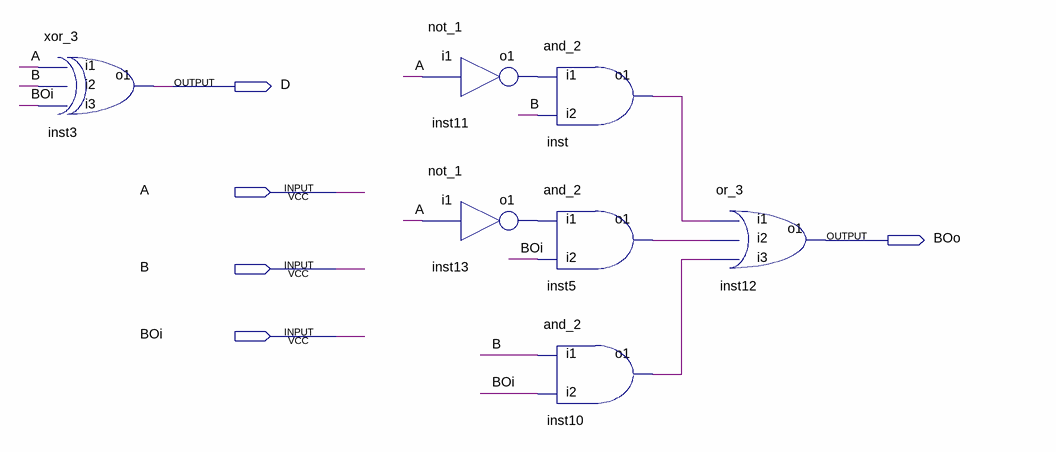
[diagram p0: schematic sheet]
// Quartus schematic FS.bdf as structural Verilog: 7 symbols, 5 pins
module FS (
  input  A,
  input  B,
  input  BOi,
  output D,
  output BOo
);

  wire inst5_o1, inst10_o1, inst11_o1, inst13_o1, inst_o1;

  xor_3 inst3 (.i1(A), .i2(B), .i3(BOi), .o1(D));
  not_1 inst11 (.i1(A), .o1(inst11_o1));
  not_1 inst13 (.i1(A), .o1(inst13_o1));
  and_2 inst (.i1(inst11_o1), .i2(B), .o1(inst_o1));
  and_2 inst5 (.i1(inst13_o1), .i2(BOi), .o1(inst5_o1));
  and_2 inst10 (.i1(B), .i2(BOi), .o1(inst10_o1));
  or_3 inst12 (.i1(inst_o1), .i2(inst5_o1), .i3(inst10_o1), .o1(BOo));
endmodule
